# Altium schematic sheet Header-Female-2.54_1x6.schdoc
size 127 x 101 mm
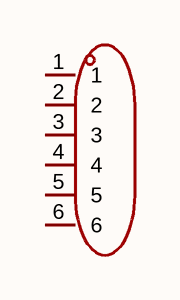
[diagram p0: Header-Female-2.54_1x6.schdoc]

## Parts
P?  2.54-1*6p母  [HDR-TH_6P-P2.54-V-F]  (value not drawn)

## Nets

Not connected (* = marked no-connect by the designer): P? 1 2 3 4 5 6

## Library data of the parts
P? = 2.54-1*6p母: Holes Structure:1x6P Pitch:2.54mm Row Spacing:- Circular Hole / Square Hole:Square Hole Mounting Type:Through Hole Number of Rows:1 Number of Positions:6P Current Rating:3A Voltage Rating (Max):- Holes Direction:Top Insulation Height:8.5mm Contact Materia; Manufacturer: BOOMELE(博穆精密); Symbol: Header-Female-2.54_1x6; AddInBom: yes; ModelId: 72da3eac8a074bb0a56a474e38d1760c; ModelTransform: 619.684,94.488,0,0,0,0,0,0,-125.984; Holes Structure: 1x6P; Pitch: 2.54mm; Number of Positions: 6P; Current Rating: 3A; Holes Direction: Top; PIN Length: 3.2mm; Supplier: LCSC; Manufacturer Part: 2.54-1*6P母; Supplier Part: C40877; JLCPCB Part Class: Extended Part; LCSC Part Name: 1x6P 间距:2.54mm 直插; Supplier Footprint: 插件,P=2.54mm; Datasheet: https://item.szlcsc.com/datasheet/2.54-1*6P%25E6%25AF%258D/41861.html; ConvertToPcb: yes; FootprintName: HDR-TH_6P-P2.54-V-F; ModelName: HDR-TH_6P-P2.54-V-F; Row Spacing: -; Circular Hole / Square Hole: Square Hole; Mounting Type: Through Hole; Number of Rows: 1; Voltage Rating (Max): -; Insulation Height: 8.5mm; Contact Material: Brass; Contact Plating: Gold; Operating Temperature: -40℃~+105℃; Supplementary Features: -